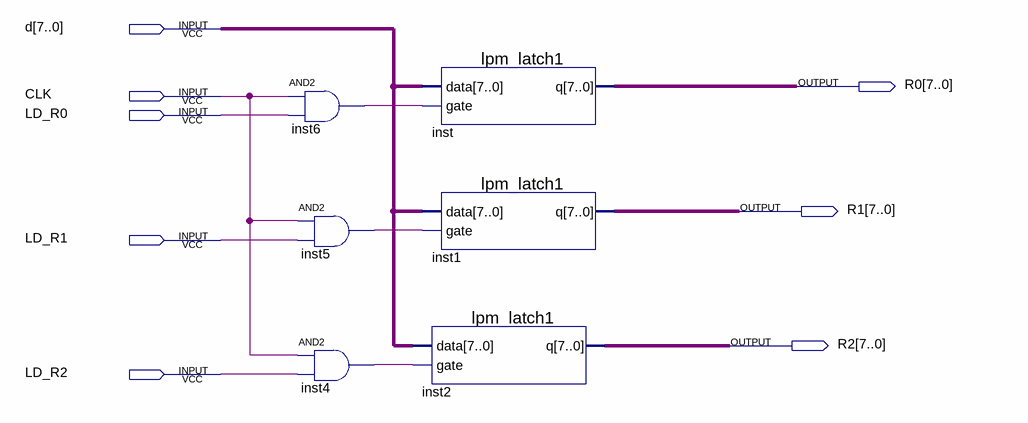
[diagram p0: schematic sheet]
// Quartus schematic pccounter.bdf as structural Verilog: 6 symbols, 8 pins
module pccounter (
  input  [7:0] d,
  input  CLK,
  input  LD_R0,
  input  LD_R1,
  input  LD_R2,
  output [7:0] R0,
  output [7:0] R1,
  output [7:0] R2
);

  wire inst4_out, inst5_out, inst6_out;

  and inst6 (inst6_out, CLK, LD_R0);
  and inst5 (inst5_out, CLK, LD_R1);
  and inst4 (inst4_out, CLK, LD_R2);
  lpm_latch1 inst2 (.data(d), .gate(inst4_out), .q(R2));
  lpm_latch1 inst (.data(d), .gate(inst6_out), .q(R0));
  lpm_latch1 inst1 (.data(d), .gate(inst5_out), .q(R1));
endmodule
